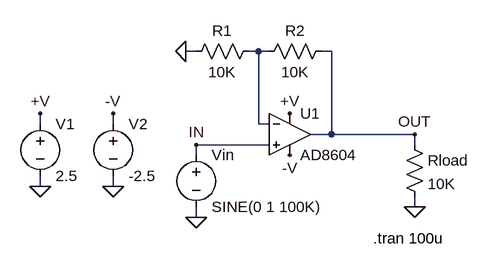
[diagram p0: schematic AD8604.asc]
AD8604.asc, the LTspice schematic file:
Version 4
SHEET 1 1240 700
WIRE 480 -880 464 -880
WIRE 576 -880 560 -880
WIRE 592 -880 576 -880
WIRE 688 -880 672 -880
WIRE 240 -768 240 -784
WIRE 352 -768 352 -784
WIRE 576 -768 576 -880
WIRE 592 -768 576 -768
WIRE 688 -752 688 -880
WIRE 688 -752 656 -752
WIRE 816 -752 688 -752
WIRE 592 -736 480 -736
WIRE 816 -736 816 -752
WIRE 480 -720 480 -736
WIRE 240 -672 240 -688
WIRE 352 -672 352 -688
WIRE 816 -640 816 -656
WIRE 480 -624 480 -640
FLAG 240 -784 +V
FLAG 240 -672 0
FLAG 480 -624 0
FLAG 816 -752 OUT
FLAG 480 -736 IN
FLAG 624 -784 +V
FLAG 352 -784 -V
FLAG 624 -720 -V
FLAG 464 -880 0
FLAG 816 -640 0
FLAG 352 -672 0
SYMBOL voltage 480 -736 R0
WINDOW 123 24 146 Left 2
WINDOW 39 24 125 Left 2
SYMATTR InstName Vin
SYMATTR Value SINE(0 1 100K)
SYMBOL Opamps\\AD8604 624 -816 R0
SYMATTR InstName U1
SYMBOL voltage 240 -784 R0
WINDOW 123 0 0 Left 2
WINDOW 39 0 0 Left 2
SYMATTR InstName V1
SYMATTR Value 2.5
SYMBOL res 576 -896 R90
WINDOW 0 0 56 VBottom 2
WINDOW 3 32 56 VTop 2
SYMATTR InstName R1
SYMATTR Value 10K
SYMBOL res 688 -896 R90
WINDOW 0 0 56 VBottom 2
WINDOW 3 32 56 VTop 2
SYMATTR InstName R2
SYMATTR Value 10K
SYMBOL voltage 352 -784 R0
WINDOW 123 24 146 Left 2
WINDOW 39 24 125 Left 2
SYMATTR InstName V2
SYMATTR Value -2.5
SYMBOL res 800 -752 R0
SYMATTR InstName Rload
SYMATTR Value 10K
TEXT 752 -592 Left 2 !.tran 100u

The netlist it stands for:
* AD8604.asc
Vin IN 0 SINE(0 1 100K)
XU1 IN N001 +V -V OUT AD8604  ; pins In+ In- V+ V- OUT
V1 +V 0 2.5
R1 N001 0 10K
R2 OUT N001 10K
V2 -V 0 -2.5
Rload OUT 0 10K
.tran 100u
.backanno
.end